# EAGLE schematic Carte USB (EAGLE 7.2.0)
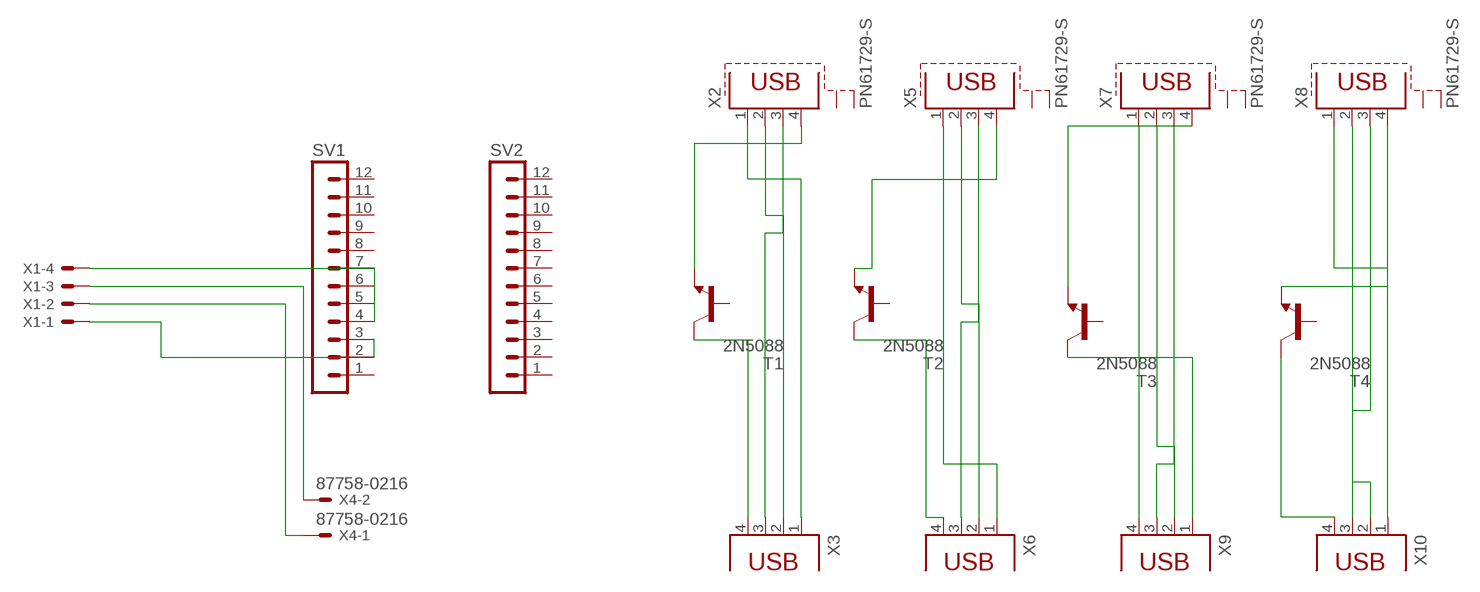
[diagram p0: schematic, sheet 1]

## Parts
SV1  MA12-1  [MA12-1]
SV2  MA12-1  [MA12-1]
T1  2N5088  [TO92]
T2  2N5088  [TO92]
T3  2N5088  [TO92]
T4  2N5088  [TO92]
X1  KK-156-4  [KK-156-4]
X2  PN61729-S  [PN61729-S]
X3  PN87520  [PN87520]
X4  87758-0216  [87758-0216]
X5  PN61729-S  [PN61729-S]
X6  PN87520  [PN87520]
X7  PN61729-S  [PN61729-S]
X8  PN61729-S  [PN61729-S]
X9  PN87520  [PN87520]
X10  PN87520  [PN87520]

## Nets
N$1: X1.3 X4.2
N$2: X1.2 X4.1
N$3: X2.1 X3.1
N$4: X2.2 X3.2
N$5: SV1.4 X1.4
N$6: SV1.3 X1.1
N$7: X2.3 X3.3
N$8: X5.3 X6.3
N$9: X5.1 X6.1
N$10: X5.2 X6.2
N$11: X7.1 X9.1
N$12: X7.2 X9.2
N$14: X7.3 X9.3
N$15: X8.1 X10.1
N$16: X8.2 X10.2
N$17: X8.3 X10.3
N$18: T1.3(E) X2.4
N$19: T1.1(C) X3.4
N$20: T2.1(C) X6.4
N$21: T2.3(E) X5.4
N$22: T3.3(E) X7.4
N$23: T3.1(C) X9.4
N$24: T4.1(C) X10.4
N$25: T4.3(E) X8.4
Unconnected: SV1.1 SV1.2 SV1.5 SV1.6 SV1.7 SV1.8 SV1.9 SV1.10 SV1.11 SV1.12 SV2.1 SV2.2 SV2.3 SV2.4 SV2.5 SV2.6 SV2.7 SV2.8 SV2.9 SV2.10 SV2.11 SV2.12 T1.2(B) T2.2(B) T3.2(B) T4.2(B) X2.S1 X2.S2 X5.S1 X5.S2 X7.S1 X7.S2 X8.S1 X8.S2

## Library data of the parts
SV1 SV2 = con-lstb:MA12-1: PIN HEADER; OC_FARNELL: unknown; OC_NEWARK: unknown
T1-T4 = transistor:2N5088: NPN TRANSISTOR
X1 = con-molex:KK-156-4: KK 156 HEADER Source: http://www.molex.com/pdm_docs/sd/026604100_sd.pdf; OC_FARNELL: unknown; OC_NEWARK: unknown
X2 X5 X7 X8 = con-berg:PN61729-S: BERG USB connector; OC_FARNELL: unknown; OC_NEWARK: unknown
X3 X6 X9 X10 = con-berg:PN87520: BERG USB connector; OC_FARNELL: unknown; OC_NEWARK: unknown
X4 = con-molex:87758-0216: 2 Pin - 2mm Dual Row Single Wafer, Vertical T/H HDR Source: http://www.molex.com/pdm_docs/sd/877580616_sd.pdf; MPN: 87758-0216; OC_FARNELL: unknown; OC_NEWARK: 94M1513